# EAGLE schematic GSServer (EAGLE 9.6.2)
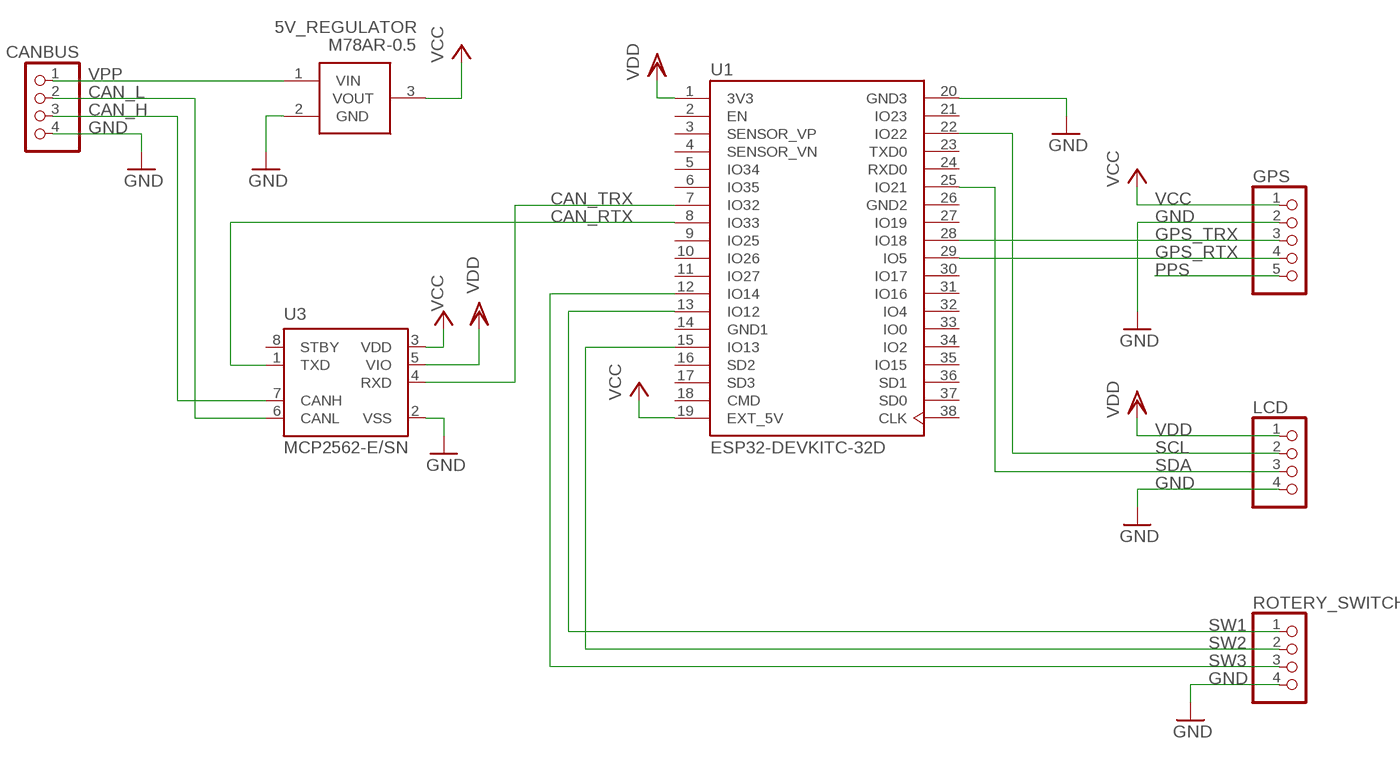
[diagram p0: schematic, sheet 1]

## Parts
5V_REGULATOR  M78AR-0.5  [SHDR3W75P0X254_1X3_1128X755X10]
CANBUS  PINHD-1X4  [1X04]
GPS  PINHD-1X5  [1X05]
LCD  PINHD-1X4  [1X04]
ROTERY_SWITCH  PINHD-1X4  [1X04]
U1  ESP32-DEVKITC-32D  [MODULE_ESP32-DEVKITC-32D]
U3  MCP2562-E/SN  [SOIC127P600X175-8N]

## Nets
CAN_H: CANBUS.3 U3.7(CANH)
CAN_L: CANBUS.2 U3.6(CANL)
CAN_RTX: U1.8(IO33) U3.1(TXD)
CAN_TRX: U1.7(IO32) U3.4(RXD)
GND: 5V_REGULATOR.2(GND) CANBUS.4 GPS.2 LCD.4 ROTERY_SWITCH.4 U1.20(GND3) U3.2(VSS)
GPS_RTX: GPS.4 U1.29(IO5)
GPS_TRX: GPS.3 U1.28(IO18)
PPS: GPS.5
SCL: LCD.2 U1.22(IO22)
SDA: LCD.3 U1.25(IO21)
SW1: ROTERY_SWITCH.1 U1.13(IO12)
SW2: ROTERY_SWITCH.2 U1.15(IO13)
SW3: ROTERY_SWITCH.3 U1.12(IO14)
VCC: 5V_REGULATOR.3(VOUT) GPS.1 U1.19(EXT_5V) U3.3(VDD)
VDD: LCD.1 U1.1(3V3) U3.5(VIO)
VPP: 5V_REGULATOR.1(VIN) CANBUS.1
Unconnected: U1.2(EN) U1.3(SENSOR_VP) U1.4(SENSOR_VN) U1.5(IO34) U1.6(IO35) U1.9(IO25) U1.10(IO26) U1.11(IO27) U1.16(SD2) U1.17(SD3) U1.18(CMD) U1.21(IO23) U1.23(TXD0) U1.24(RXD0) U1.27(IO19) U1.30(IO17) U1.31(IO16) U1.32(IO4) U1.33(IO0) U1.34(IO2) U1.35(IO15) U1.36(SD1) U1.37(SD0) U1.38(CLK) U3.8(STBY)

## Power pins joined to a net without a drawn wire
GND1: U1.14(GND1)
GND2: U1.26(GND2)

## Library data of the parts
5V_REGULATOR = M78AR-0.5:M78AR-0.5: Switching Regulator 0.5A, SIP Package Source: Datasheet <http://www.minmax.com.tw/upfiles/all_/all_quickfiles_caty01451992608.pdf>; DESCRIPTION: Switching Regulator 0.5A, SIP Package; HEIGHT: 10.7mm; MANUFACTURER_NAME: Minmax; MANUFACTURER_PART_NUMBER: M78AR-0.5
CANBUS LCD ROTERY_SWITCH = pinhead:PINHD-1X4: PIN HEADER
GPS = pinhead:PINHD-1X5: PIN HEADER
U1 = ESP32-DEVKITC-32D:ESP32-DEVKITC-32D: Eval Board For Esp-Wroom-32 Check availability <https://pricing.snapeda.com/parts/ESP32-DEVKITC-32D/Espressif%20Systems/view-part?ref=eda>; AVAILABILITY: In Stock; DESCRIPTION: WiFi Development Tools (802.11) ESP32 General Development Kit, ESP32-WROOM-32D on the board; MF: Espressif Systems; MP: ESP32-DEVKITC-32D; PACKAGE: None; PRICE: None; PURCHASE-URL: https://pricing.snapeda.com/search/part/ESP32-DEVKITC-32D/?ref=eda
U3 = mcp2562-E_SN:MCP2562-E/SN: MCP2562 Series 5 V Surface Mount High-Speed CAN Transceiver - SOIC-8; AVAILABILITY: Unavailable; DESCRIPTION: Microchip MCP2562-E/SN, CAN Transceiver 1MBps 1-channel IEC 61000-4-2, 8-Pin SOIC; MF: Microchip; MP: MCP2562-E/SN; PACKAGE: SO-8 Microchip; PRICE: None